# EAGLE schematic ioh (EAGLE 6.5.0)
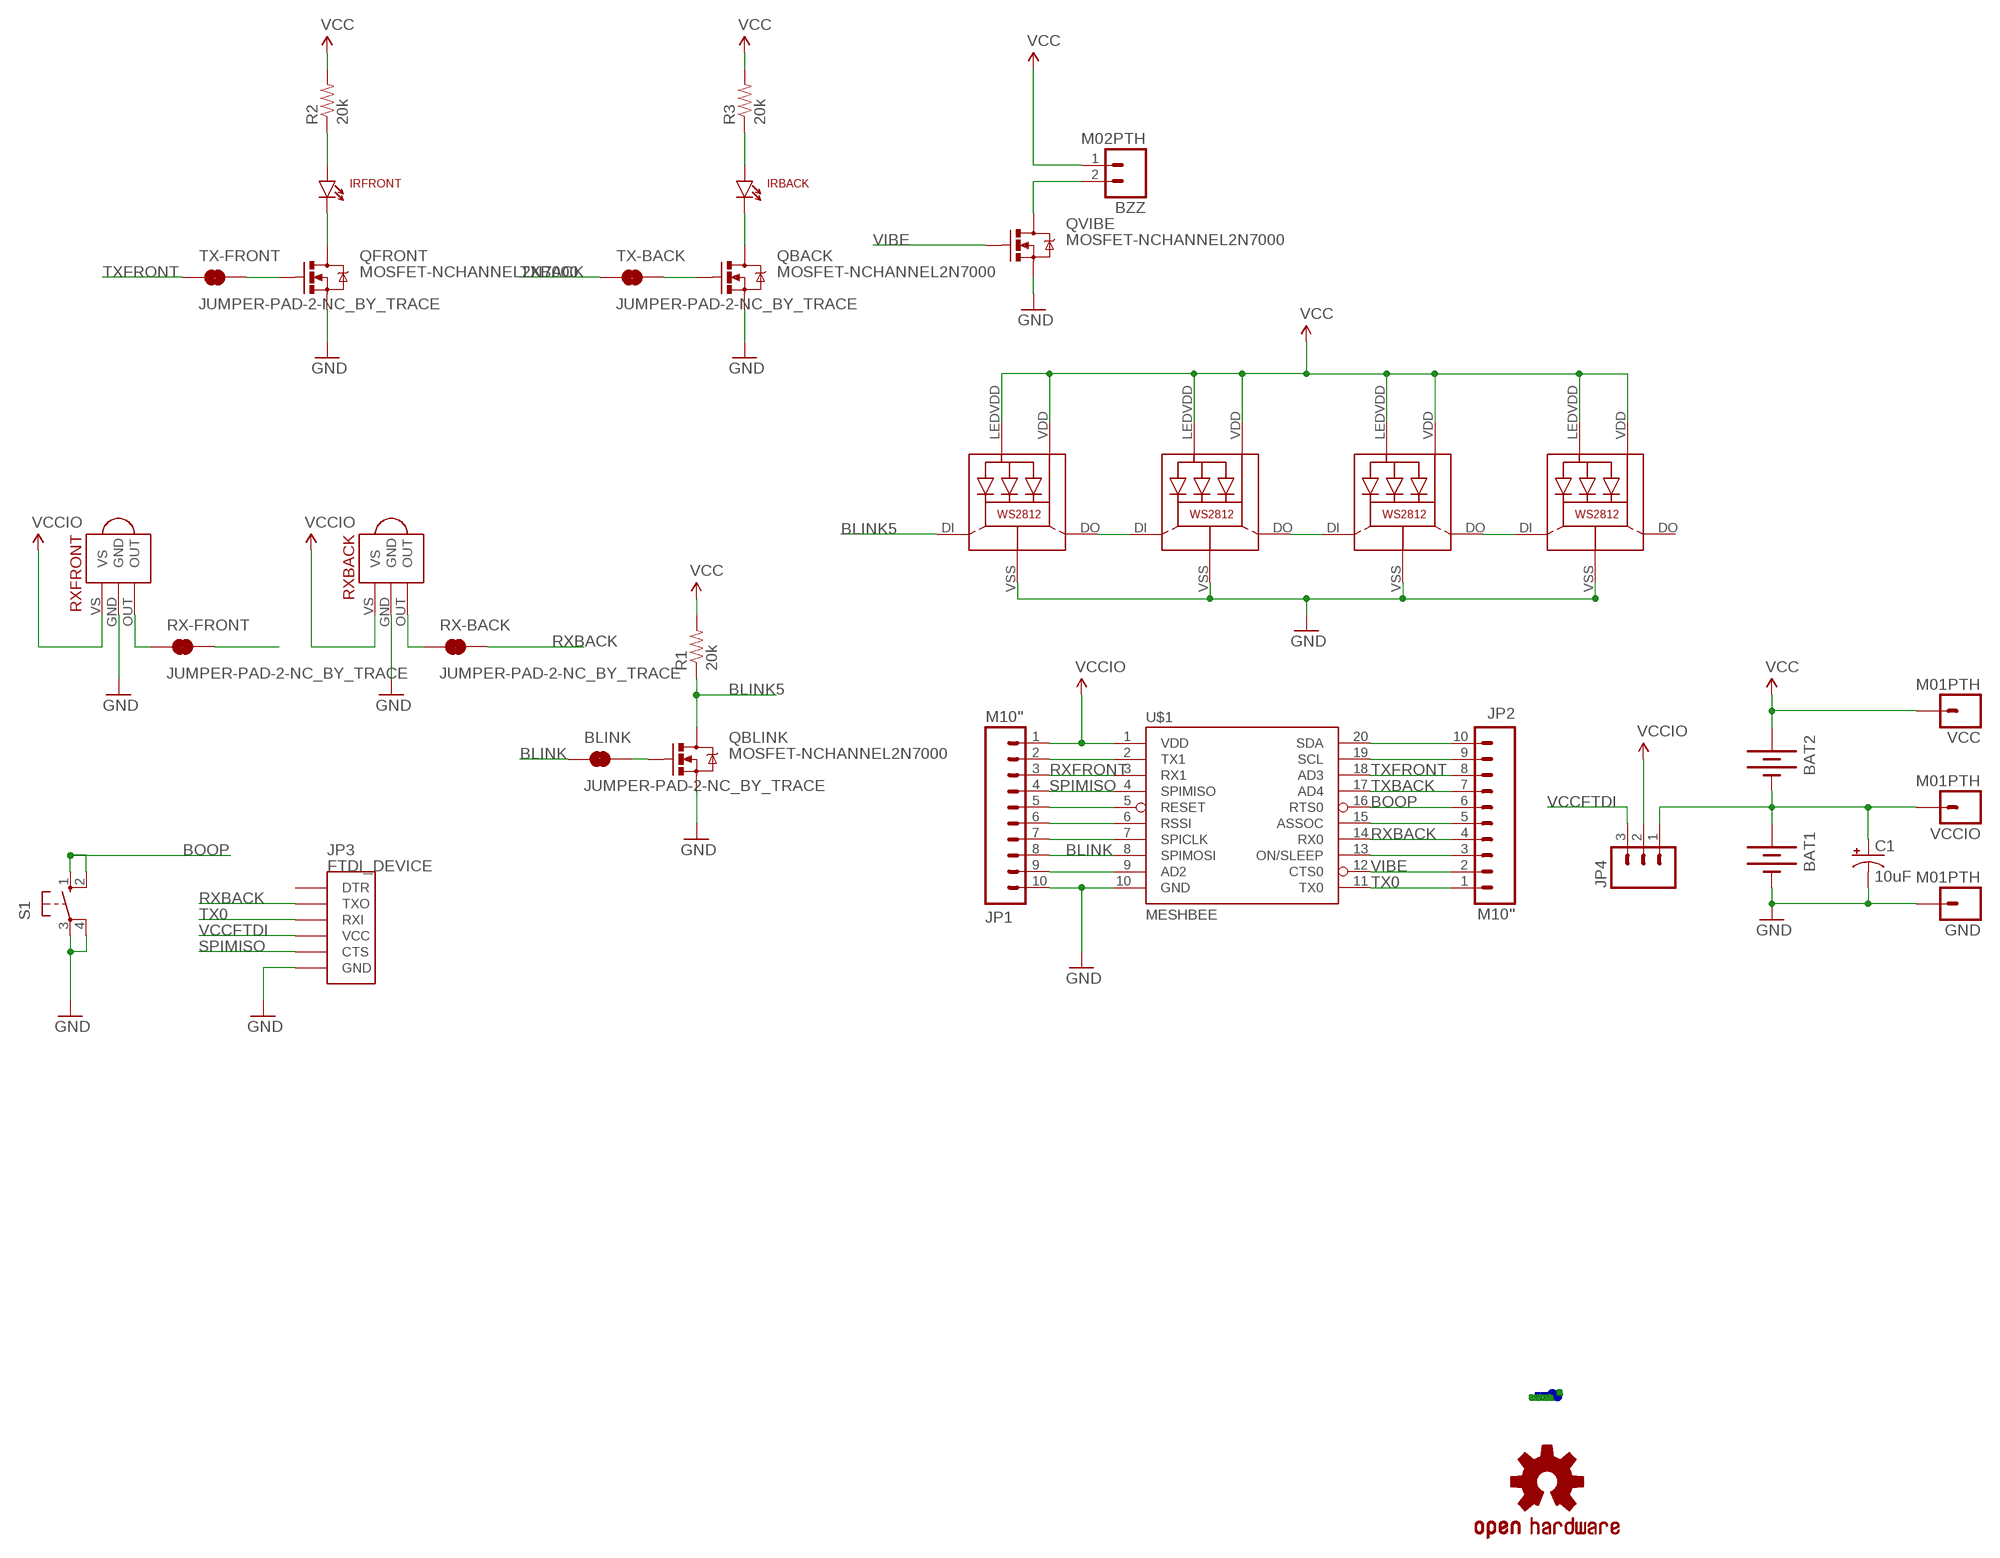
[diagram p0: schematic, sheet 1]

## Parts
BAT1  BATTERY20PTH  [BATTCOM_20MM_PTH]
BAT2  BATTERY20PTH  [BATTCOM_20MM_PTH]
BLINK  JUMPER-PAD-2-NC_BY_TRACE  [PAD-JUMPER-2-NC_BY_TRACE_YES_SILK]
BZZ  M02PTH  [1X02]
C1  10uF  10UF-25V-20%(PTH)KIT  [CPOL-RADIAL-10UF-25V-KIT]
GND  M01PTH  [1X01]
IRBACK  LTE-302  [LTE-302]
IRFRONT  LTE-302  [LTE-302]
JP1  M10"  [1X10]
JP2  M10"  [1X10]
JP3  FTDI_DEVICE  [FTDI_DEVICE_SIDE]
JP4  M03LOCK  [1X03_LOCK]
LED2  WS2812  [WS2812]
LED3  WS2812  [WS2812]
LED4  WS2812  [WS2812]
LED5  WS2812  [WS2812]
LOGO1  OSHW-LOGOS  [OSHW-LOGO-S]
QBACK  MOSFET-NCHANNEL2N7000  [TO-92]
QBLINK  MOSFET-NCHANNEL2N7000  [TO-92]
QFRONT  MOSFET-NCHANNEL2N7000  [TO-92]
QVIBE  MOSFET-NCHANNEL2N7000  [TO-92]
R1  20k  RESISTORPTH-1/4W  [AXIAL-0.4]
R2  20k  RESISTORPTH-1/4W  [AXIAL-0.4]
R3  20k  RESISTORPTH-1/4W  [AXIAL-0.4]
RX-BACK  JUMPER-PAD-2-NC_BY_TRACE  [PAD-JUMPER-2-NC_BY_TRACE_YES_SILK]
RX-FRONT  JUMPER-PAD-2-NC_BY_TRACE  [PAD-JUMPER-2-NC_BY_TRACE_YES_SILK]
RXBACK  TSOP2438  [TSOP2438]
RXFRONT  TSOP2438  [TSOP2438]
S1  40-XX  [B3F-40XX]
TX-BACK  JUMPER-PAD-2-NC_BY_TRACE  [PAD-JUMPER-2-NC_BY_TRACE_YES_SILK]
TX-FRONT  JUMPER-PAD-2-NC_BY_TRACE  [PAD-JUMPER-2-NC_BY_TRACE_YES_SILK]
U$1  MESHBEE  [MESHBEE]
U$2  BSIDES  [BSIDES]
VCC  M01PTH  [1X01]
VCCIO  M01PTH  [1X01]

## Nets
BLINK: BLINK.1 JP1.8 U$1.8(SPIMOSI)
BLINK5: LED2.DI QBLINK.3(D) R1.P$1
BOOP: JP2.6 S1.1(S) S1.2(S1) U$1.16(RTS0)
GND: BAT1.2(-) C1.2(-) GND.1 JP1.10 JP3.P$6(GND) LED2.VSS(GND) LED3.VSS(GND) LED4.VSS(GND) LED5.VSS(GND) QBACK.1(S) QBLINK.1(S) QFRONT.1(S) QVIBE.1(S) RXBACK.GND RXFRONT.GND S1.3(P) S1.4(P1) U$1.10(GND)
N$1: LED2.DO LED3.DI
N$2: LED3.DO LED4.DI
N$3: LED4.DO LED5.DI
N$4: IRFRONT.A R2.P$1
N$5: JP1.2 U$1.2(TX1)
N$6: BLINK.2 QBLINK.2(G)
N$8: JP1.5 U$1.5(RESET)
N$9: JP1.6 U$1.6(RSSI)
N$10: JP1.7 U$1.7(SPICLK)
N$11: IRFRONT.C QFRONT.3(D)
N$12: JP1.9 U$1.9(AD2)
N$13: BZZ.2 QVIBE.3(D)
N$14: BAT1.1(+) BAT2.2(-) C1.1(+) JP4.1 VCCIO.1
N$15: RX-BACK.1 RXBACK.OUT
N$16: JP2.3 U$1.13(ON/SLEEP)
N$17: RX-FRONT.1 RXFRONT.OUT
N$18: JP2.5 U$1.15(ASSOC)
N$20: QFRONT.2(G) TX-FRONT.2
N$21: QBACK.2(G) TX-BACK.2
N$22: JP2.9 U$1.19(SCL)
N$23: JP2.10 U$1.20(SDA)
N$24: IRBACK.A R3.P$1
N$25: IRBACK.C QBACK.3(D)
RXBACK: JP2.4 JP3.P$2(TXO) RX-BACK.2 U$1.14(RX0)
RXFRONT: JP1.3 RX-FRONT.2 U$1.3(RX1)
SPIMISO: JP1.4 JP3.P$5(CTS) U$1.4(SPIMISO)
TX0: JP2.1 JP3.P$3(RXI) U$1.11(TX0)
TXBACK: JP2.7 TX-BACK.1 U$1.17(AD4)
TXFRONT: JP2.8 TX-FRONT.1 U$1.18(AD3)
VCC: BAT2.1(+) BZZ.1 LED2.LEDVDD LED2.VDD LED3.LEDVDD LED3.VDD LED4.LEDVDD LED4.VDD LED5.LEDVDD LED5.VDD R1.P$2 R2.P$2 R3.P$2 VCC.1
VCCFTDI: JP3.P$4(VCC) JP4.3
VCCIO: JP1.1 JP4.2 RXBACK.VS RXFRONT.VS U$1.1(VDD)
VIBE: JP2.2 QVIBE.2(G) U$1.12(CTS0)
Unconnected: JP3.P$1(DTR) LED5.DO

## Library data of the parts
BAT1 BAT2 = SparkFun-Electromechanical:BATTERY: Battery Holders Various common sizes : AA, AAA, 20mm coin cell and 12mm coin cell. 20MM_4LEGS, BATT-10373
BLINK RX-BACK RX-FRONT TX-BACK TX-FRONT = SparkFun-Passives:JUMPER-PAD-2-NC_BY_TRACE
BZZ = SparkFun-Connectors:M02: Standard 2-pin 0.1" header. Use with - straight break away headers ( PRT-00116) - right angle break away headers (PRT-00553) - swiss pins (PRT-00743) - machine pins (PRT-00117) - female headers (PRT-00115) Molex polarized connector foot print use with: PRT-08233 with associated crimp pins and housings. 2.54_SCREWTERM for use with PRT-10571. 3.5mm Screw Terminal footprints for PRT-08084 5mm Screw Terminal footprints for use with PRT-08432
C1 = SparkFun-Capacitors:10UF-25V-20%(PTH): CAP-08440; PROD_ID: CAP-08440
GND VCC VCCIO = SparkFun-Connectors:M01: Header 1 Standard 1-pin 0.1" header. Use with straight break away headers (SKU : PRT-00116), right angle break away headers (PRT-00553), swiss pins (PRT-00743), machine pins (PRT-00117), and female headers (PRT-00115).
IRBACK IRFRONT = SparkFun-LED:LTE-302: Through-hole side-firing 940nm IR LED
JP1 JP2 = SparkFun-Connectors:M10: Header 10 Standard 10-pin 0.1" header. Use with straight break away headers (SKU : PRT-00116), right angle break away headers (PRT-00553), swiss pins (PRT-00743), machine pins (PRT-00117), and female headers (PRT-00115).
JP3 = SparkFun-Connectors:FTDI_DEVICE: Connector which mates to FTDI basic or FTDI cable.
JP4 = SparkFun-Connectors:M03: Header 3 Standard 3-pin 0.1" header. Use with straight break away headers (SKU : PRT-00116), right angle break away headers (PRT-00553), swiss pins (PRT-00743), machine pins (PRT-00117), and female headers (PRT-00115). Molex polarized connector foot print use with SKU : PRT-08232 with associated crimp pins and housings.
LED2-LED5 = adafruit:WS2812
LOGO1 = SparkFun-Aesthetics:OSHW-LOGO: Open Source Hardware Logo This logo indicates the piece of hardware it is found on incorporates a OSHW license and/or adheres to the definition of open source hardware found here: http://freedomdefined.org/OSHW
QBACK QBLINK QFRONT QVIBE = SparkFun-DiscreteSemi:MOSFET-NCHANNEL: Common NMOSFET Parts MFG P/N Store ID Prod ID FDD8780 TRANS-09984 SI7820DN TRANS-11055 FDS6630A IC-08089 2N7002PW TRANS-11151 FQP30N06L COM-10213 TRANS-10060 BSS123LT1G TRANS-08345 BSS138 TRANS-00830 BS170 2N7000
R1-R3 = SparkFun-Resistors:RESISTOR: Resistor Basic schematic elements and footprints for 0603, 1206, and PTH resistors.
RXBACK RXFRONT = ioh-1:TSOP2438
S1 = adafruit:40-XX: OMRON SWITCH; MF: OMRON COMPONENTS USA; MPN: B3F-4000; OC_FARNELL: 176434; OC_NEWARK: 36K3105
U$1 = ioh-1:MESHBEE: meshbee module
U$2 = ioh-1:BSIDES